# Altium project PCB_DoXeArduino_RFID.PrjPcb
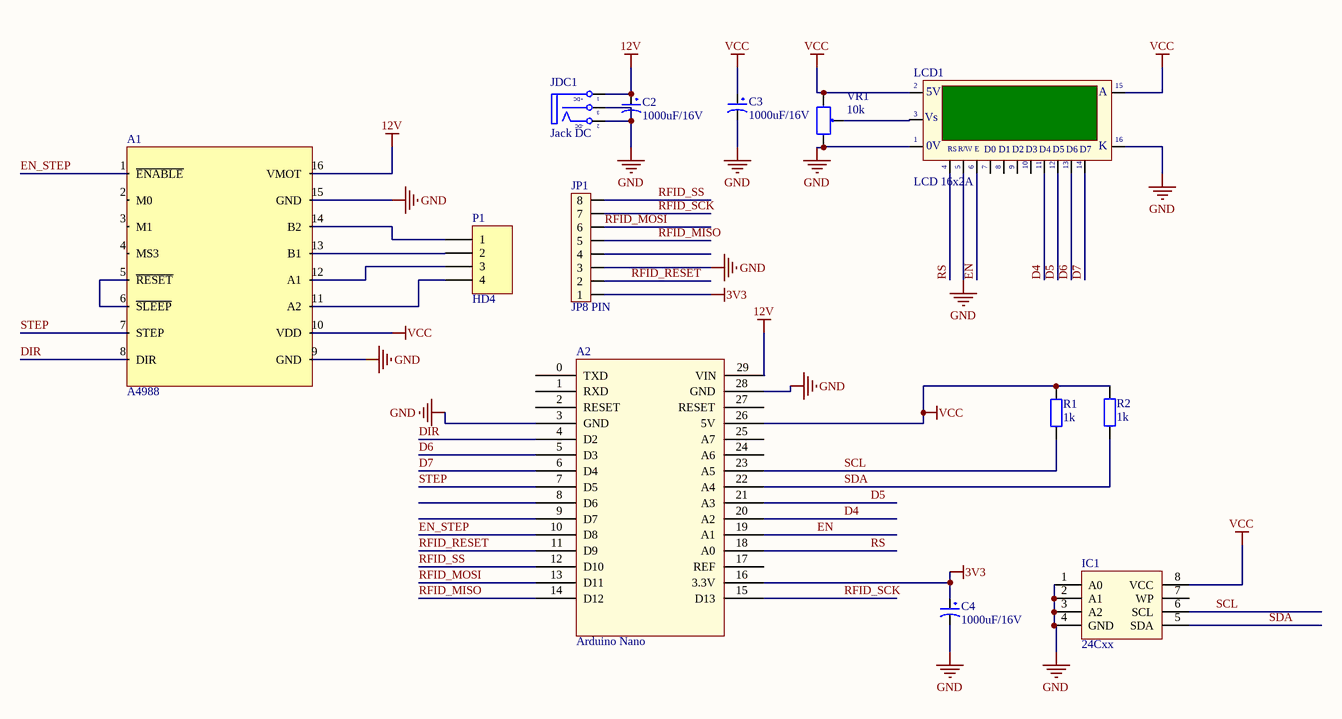
[diagram p0: DoXeArduino_RFID.SchDoc]
1 sheet, 13 parts. Net scope: global (net labels, ports and power ports of the same name join across sheets).
Board file: DoXeArrduino_RFID.PcbDoc

## Sheet DoXeArduino_RFID.SchDoc
size A0

### Parts
A1  A4988  [A4988]
A2  Arduino Nano  [Arduino Nano]
C2  1000uF/16V  [CP1.5/3.4]
C3  1000uF/16V  [CP1.5/3.4]
C4  1000uF/16V  [CP1.5/3.4]
IC1  24Cxx  [DIP8/W0.3]
JDC1  Jack DC  [DC0]
JP1  JP8 PIN  [JP8]
LCD1  LCD 16x2A  [LCD16X2]
P1  HD4  [HEADER 4]
R1  1k  [RES-SMD-0805]
R2  1k  [RES-SMD-0805]
VR1  10k  [VR-S2]

### Nets
3V3: A2.16(3.3V) C4.1 JP1.1
12V: A1.16(VMOT) A2.29(VIN) C2.1 JDC1.1(T)
GND: A1.9(GND) A1.15(GND) A2.3(GND) A2.28(GND) C2.2 C3.2 C4.2 IC1.1(A0) IC1.2(A1) IC1.3(A2) IC1.4(GND) JDC1.2(TN) JDC1.3(S) JP1.3 LCD1.1(GND) LCD1.5(R/~{W}) LCD1.16(K) VR1.3
VCC: A1.10(VDD) A2.26(5V) C3.1 IC1.8(VCC) LCD1.2(VDD) LCD1.15(A) R1.2 R2.2 VR1.1
D4: A2.20(A2) LCD1.11(D4)
D5: A2.21(A3) LCD1.12(D5)
D6: A2.5(D3) LCD1.13(D6)
D7: A2.6(D4) LCD1.14(D7)
DIR: A1.8(DIR) A2.4(D2)
EN: A2.19(A1) LCD1.6(~{EN})
EN_STEP: A1.1(~{ENABLE}) A2.10(D8)
RFID_MISO: A2.14(D12) JP1.5
RFID_MOSI: A2.13(D11) JP1.6
RFID_RESET: A2.11(D9) JP1.2
RFID_SCK: A2.15(D13) JP1.7
RFID_SS: A2.12(D10) JP1.8
RS: A2.18(A0) LCD1.4(RS)
SCL: A2.23(A5) IC1.6(SCL) R1.1
SDA: A2.22(A4) IC1.5(SDA) R2.1
STEP: A1.7(STEP) A2.7(D5)
NetA1_5: A1.5(~{RESET}) A1.6(~{SLEEP})
NetA1_11: A1.11(A2) P1.4
NetA1_12: A1.12(A1) P1.3
NetA1_13: A1.13(B1) P1.2
NetA1_14: A1.14(B2) P1.1
NetLCD1_3: LCD1.3(VEE) VR1.2

Not connected (* = marked no-connect by the designer): A1 2(M0) 3(M1) 4(MS3); A2 0(TXD) 1(RXD) 2(RESET) 8(D6) 9(D7) 17(REF) 24(A6) 25(A7) 27(RESET); IC1 7(WP); JP1 4; LCD1 7(D0) 8(D1) 9(D2) 10(D3)

### Notes on the sheet
- (in symbol JACK_DC) +DC; -DC
- (in symbol LCD16x2A) 5V; Vs; |; 0V; R/W; E

### Library data of the parts
C2-C4 = CP4: Cap 1000uF/16V - 220uF/50V; Description 5: 4,7uF>10uF/250V_3,3uF>10uF/400V - 2,2uF>4,7uF/450V; Description 1: 2200uF-3300uF/6,3V - 1000uF-2200uF/10V; Description 2: 1000uF/16V - 470uF => 1000uF/25V - 100uF/100V; Description 3: 330uF>470uF/35V_220uF>470uF/50V_10uF>22uF/250V; Description 4: 220uF => 330uF/63V - 10uF =>33uF/160 - 200V; Value: 1000uF/16V
IC1 = 24Cxx: Standard 2-Wire Bus Interface Serial EEPROM; Value: DIP 8; Value: 24Cxx; Copyright by: VanDungEvn
JDC1 = JACK_DC
JP1 = JP8: Value: JP7
LCD1 = LCD16x2A: LCD dipslay 16 char, 2 line; Value: LCD16x2A
P1 = HEADER 4
R1 R2 = R: Resistor R1/4W
VR1 = Resistor Var